# Altium project RT_SUPER_EXT.PrjPcb
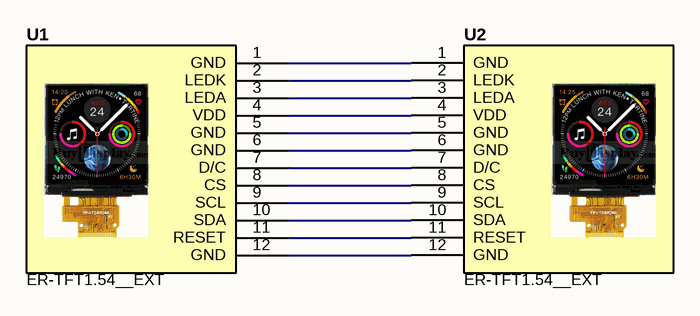
[diagram p0: RT_SUPER_EXT.SchDoc]
SCH_DATE: 2021-09-02; PROJECT_TITLE_LINE_1: RT_SUPER_EXT; PROJECT_STATUS: PROTOTYPE; PROJECT_ENGINEER: E. Hughes; PCB_VERSION: A; PCB_TITLE: RT_SUPER_EXT; PCB_SOLDER_MASK_COLOR_TOP: BLACK; PCB_SOLDER_MASK_COLOR_BOTTOM: BLACK; PCB_SILKSCREEN_COLOR_TOP: WHITE; PCB_SILKSCREEN_COLOR_BOTTOM: WHITE; PCB_PRINTOUT_SCALE: 1:1; PCB_PART_NUMBER: RT_SUPER_EXT; PCB_MIN_TRACE_WIDTH: 5; PCB_MIN_TRACE_SPACE: 5; PCB_MIN_DRILL: 6; PCB_MATERIAL: FR4; PCB_LAYERS: 4; PCB_FINISH_PLATING: GOLD ENIG; PCB_FINISHED_THICKNESS: 31.25; PCB_DRC_DATE: X; PCB_COPPER_WEIGHT_OUTER: 1oz; PCB_COPPER_WEIGHT_INNER: 1oz; CCA_TITLE: RT_SUPER_EXT; CCA_PART_NUMBER: RT_SUPER_EXT; BOM_NOTES_LINE_4: -; BOM_NOTES_LINE_3: -; BOM_NOTES_LINE_2: -; BOM_NOTES_LINE_1: -; APPROVAL_REVIEWED_DATE: -; APPROVAL_REVIEWED: -; APPROVAL_ENGINEER_DATE: -; APPROVAL_ENGINEER: -; APPROVAL_DRAWN_DATE: -; APPROVAL_DRAWN: -; APPROVAL_CHECKED_DATE: -; APPROVAL_APPROVED_2_DATE: -; APPROVAL_APPROVED_2: -; APPROVAL_APPROVED_1_DATE: -; APPROVAL_APPROVED_1: -
1 sheet, 2 parts. Net scope: global (net labels, ports and power ports of the same name join across sheets).
Board file: RT_SUPER_EXT.PCBdoc

## Sheet RT_SUPER_EXT.SchDoc
size A

### Parts
U1  ER-TFT1.54__EXT  [ER-TFT1.54-1 - EXT]
U2  ER-TFT1.54__EXT  [ER-TFT1.54-1 - EXT]

### Nets
NetU1_1: U1.1(GND) U2.1(GND)
NetU1_2: U1.2(LEDK) U2.2(LEDK)
NetU1_3: U1.3(LEDA) U2.3(LEDA)
NetU1_4: U1.4(VDD) U2.4(VDD)
NetU1_5: U1.5(GND) U2.5(GND)
NetU1_6: U1.6(GND) U2.6(GND)
NetU1_7: U1.7(D/C) U2.7(D/C)
NetU1_8: U1.8(CS) U2.8(CS)
NetU1_9: U1.9(SCL) U2.9(SCL)
NetU1_10: U1.10(SDA) U2.10(SDA)
NetU1_11: U1.11(RESET) U2.11(RESET)
NetU1_12: U1.12(GND) U2.12(GND)

### Library data of the parts
U1 U2 = ER-TFT1.54__EXT: EXTENTION FOOTPRINT; Manufacturer: Buy Display; Manufacturer Part Number: ER-TFT1.54-1; Value: ER-TFT1.54__EXT

## Assembly variants
B: all parts fitted